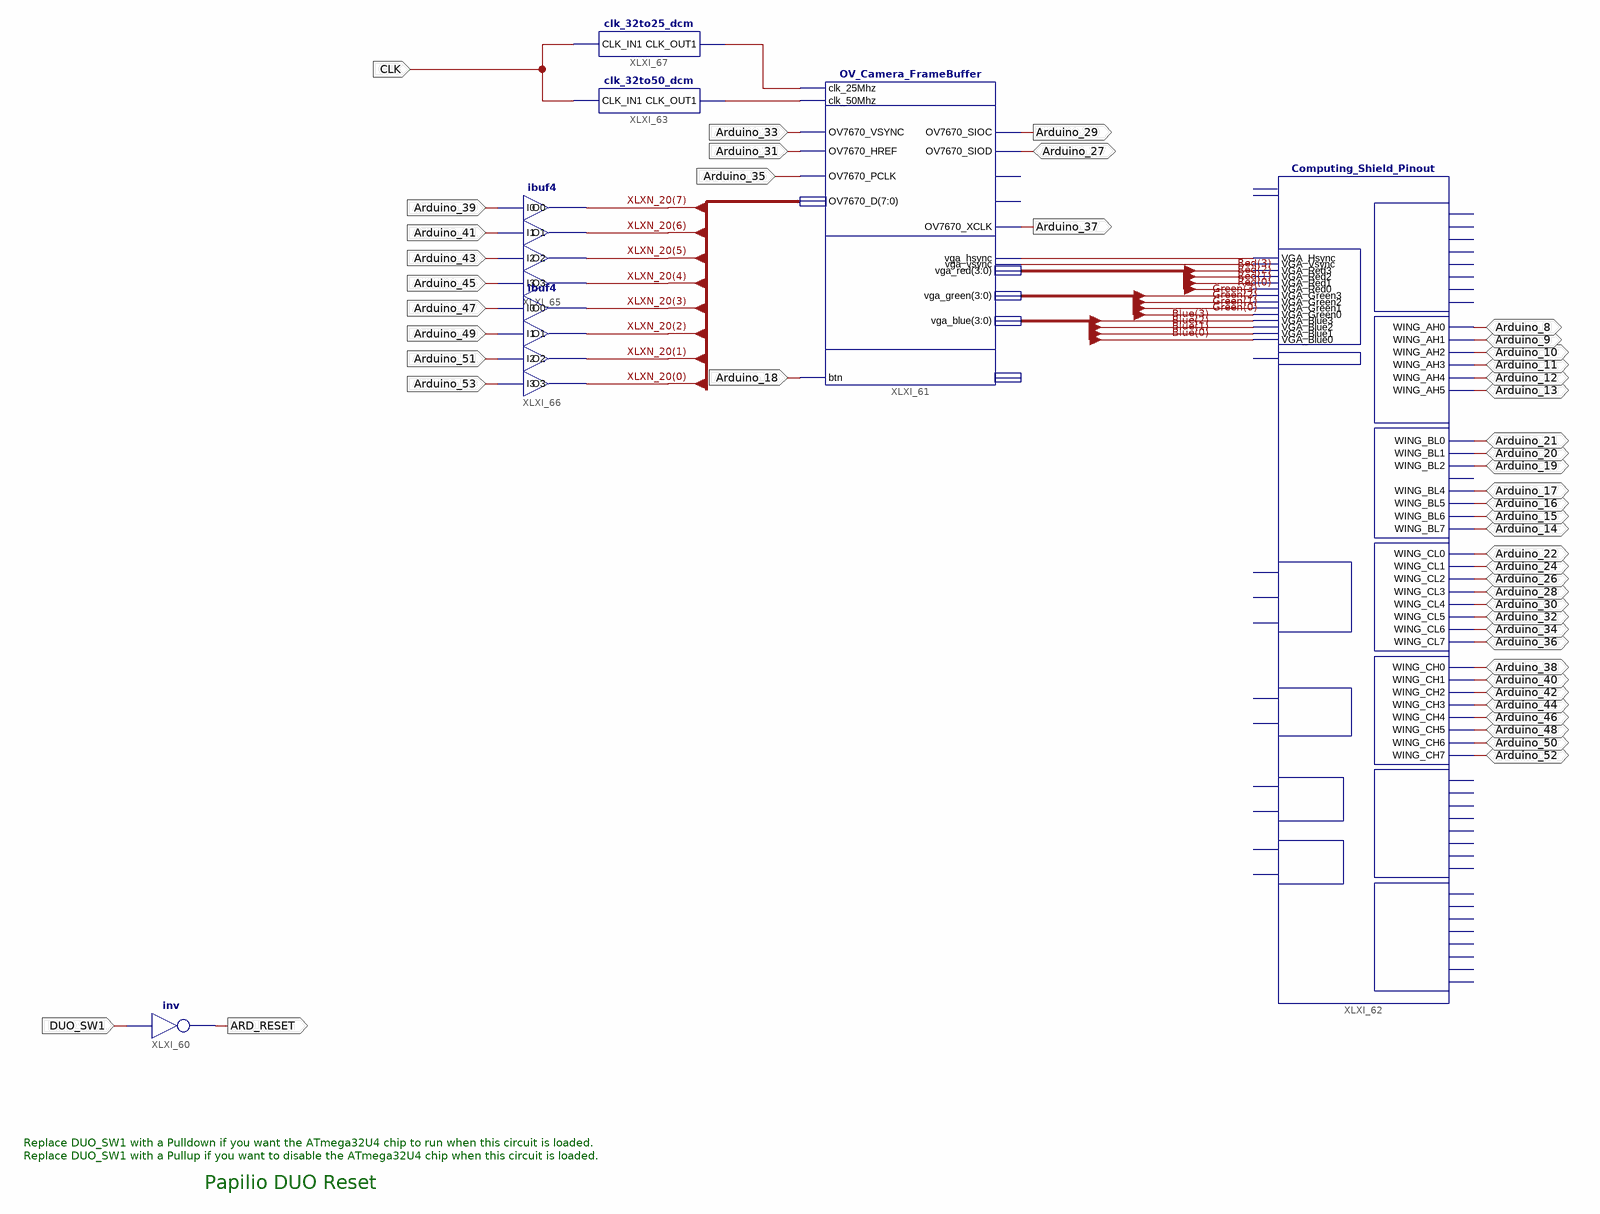
[diagram p0: schematic sheet 1]
// Xilinx ISE schematic Papilio_DUO_LX9.sch (spartan6) as structural Verilog: 7 symbols, 47 ports
module Papilio_DUO_LX9 (
  input  DUO_SW1,
  input  Arduino_39,
  input  Arduino_41,
  input  Arduino_43,
  input  Arduino_45,
  input  Arduino_47,
  input  Arduino_49,
  input  Arduino_51,
  input  Arduino_53,
  input  Arduino_33,
  input  Arduino_31,
  input  Arduino_35,
  input  Arduino_18,
  input  CLK,
  inout  Arduino_52,
  inout  Arduino_50,
  inout  Arduino_48,
  inout  Arduino_46,
  inout  Arduino_44,
  inout  Arduino_42,
  inout  Arduino_40,
  inout  Arduino_38,
  inout  Arduino_36,
  inout  Arduino_34,
  inout  Arduino_32,
  inout  Arduino_30,
  inout  Arduino_28,
  inout  Arduino_26,
  inout  Arduino_24,
  inout  Arduino_22,
  inout  Arduino_14,
  inout  Arduino_15,
  inout  Arduino_16,
  inout  Arduino_17,
  inout  Arduino_19,
  inout  Arduino_20,
  inout  Arduino_21,
  inout  Arduino_13,
  inout  Arduino_12,
  inout  Arduino_11,
  inout  Arduino_10,
  inout  Arduino_9,
  inout  Arduino_8,
  inout  Arduino_27,
  output ARD_RESET,
  output Arduino_37,
  output Arduino_29
);

  wire XLXN_1, XLXN_2, XLXN_17, XLXN_21;
  wire [3:0] Blue, Green, Red;
  wire [7:0] XLXN_20;

  not XLXI_60 (ARD_RESET, DUO_SW1);
  OV_Camera_FrameBuffer XLXI_61 (
    .clk_50Mhz(XLXN_17), .OV7670_SIOC(Arduino_29), .OV7670_VSYNC(Arduino_33), .OV7670_D(XLXN_20),
    .OV7670_XCLK(Arduino_37), .OV7670_SIOD(Arduino_27), .OV7670_HREF(Arduino_31), .OV7670_PCLK(Arduino_35),
    .vga_hsync(XLXN_1), .vga_vsync(XLXN_2), .vga_red(Red), .vga_green(Green), .vga_blue(Blue),
    .btn(Arduino_18), .clk_25Mhz(XLXN_21));  // open: OV7670_RESET, OV7670_PWDN, LED
  Computing_Shield_Pinout XLXI_62 (
    .WING_AH0(Arduino_8), .WING_AH1(Arduino_9), .WING_AH2(Arduino_10), .WING_AH3(Arduino_11),
    .WING_AH4(Arduino_12), .WING_AH5(Arduino_13), .VGA_Red2(Red[2]), .VGA_Red1(Red[1]), .VGA_Red0(Red[0]),
    .VGA_Green2(Green[2]), .VGA_Green1(Green[1]), .VGA_Green0(Green[0]), .VGA_Hsync(XLXN_1),
    .VGA_Vsync(XLXN_2), .WING_CL0(Arduino_22), .WING_CL1(Arduino_24), .WING_CL2(Arduino_26),
    .WING_CL3(Arduino_28), .WING_CL4(Arduino_30), .WING_CL5(Arduino_32), .WING_CL6(Arduino_34),
    .WING_CL7(Arduino_36), .WING_CH0(Arduino_38), .WING_CH1(Arduino_40), .WING_CH2(Arduino_42),
    .WING_CH3(Arduino_44), .WING_CH4(Arduino_46), .WING_CH5(Arduino_48), .WING_CH6(Arduino_50),
    .WING_CH7(Arduino_52), .WING_BL0(Arduino_21), .WING_BL1(Arduino_20), .WING_BL2(Arduino_19),
    .WING_BL4(Arduino_17), .WING_BL5(Arduino_16), .WING_BL6(Arduino_15), .WING_BL7(Arduino_14),
    .VGA_Red3(Red[3]), .VGA_Green3(Green[3]), .VGA_Blue3(Blue[3]), .VGA_Blue1(Blue[1]), .VGA_Blue0(Blue[0]),
    .VGA_Blue2(Blue[2]));  // open: gpio_bus_out, gpio_bus_in, WING_AL0, WING_AL1, WING_AL2, WING_AL3, WING_AL4, WING_AL5, WING_AL6, WING_AL7, Audio1_Left, SD_MISO, SD_MOSI, RS232_RX, RS232_TX, SD_SCK, Audio1_Right, Audio2_Right, Audio2_Left, WING_BL3, WING_DL0, WING_DL1, WING_DL2, WING_DL3, WING_DL4, WING_DL5, WING_DL6, WING_DL7, WING_DH0, WING_DH1, WING_DH2, WING_DH3, WING_DH4, WING_DH5, WING_DH6, WING_DH7, VGA_Bus
  clk_32to50_dcm XLXI_63 (.CLK_IN1(CLK), .CLK_OUT1(XLXN_17));
  ibuf4 XLXI_65 (
    .I0(Arduino_39), .I1(Arduino_41), .I2(Arduino_43), .I3(Arduino_45), .O0(XLXN_20[7]), .O1(XLXN_20[6]),
    .O2(XLXN_20[5]), .O3(XLXN_20[4]));
  ibuf4 XLXI_66 (
    .I0(Arduino_47), .I1(Arduino_49), .I2(Arduino_51), .I3(Arduino_53), .O0(XLXN_20[3]), .O1(XLXN_20[2]),
    .O2(XLXN_20[1]), .O3(XLXN_20[0]));
  clk_32to25_dcm XLXI_67 (.CLK_IN1(CLK), .CLK_OUT1(XLXN_21));

  // Notes on the sheet:
  //   Replace DUO_SW1 with a Pulldown if you want the ATmega32U4 chip to run when this circuit is loaded.
  //   Replace DUO_SW1 with a Pullup if you want to disable the ATmega32U4 chip when this circuit is loaded.
  //   Papilio DUO Reset
endmodule
